# EAGLE design ESP_LoRa_1.5 (EAGLE 9.6.2)
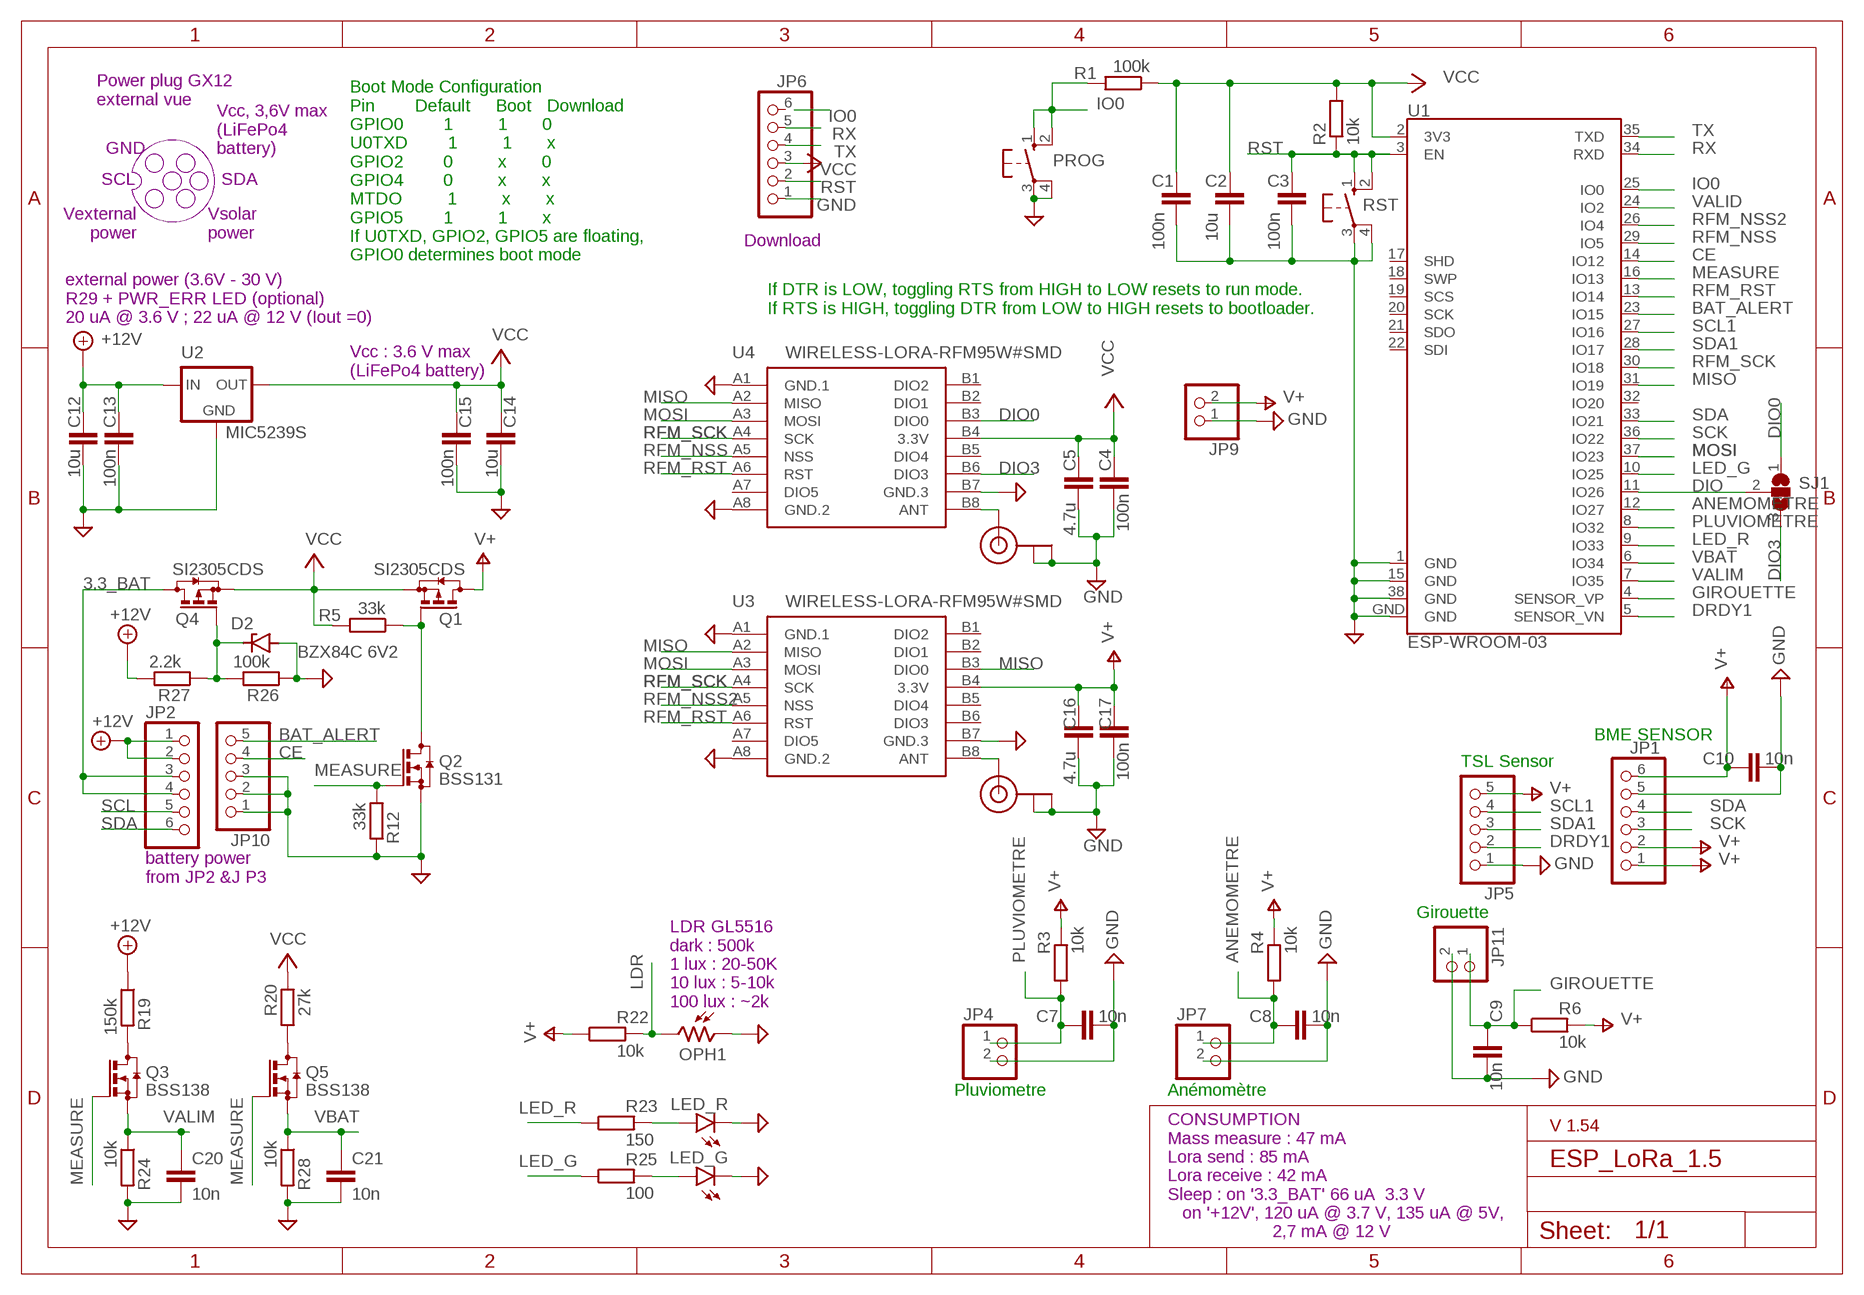
[diagram p0: schematic, sheet 1]

## Parts
C1  100n  CC1206  [C1206]
C2  10u  CC1210  [C1210]
C3  100n  CC1206  [C1206]
C4  100n  CC1206  [C1206]
C5  4.7u  CC1210  [C1210]
C7  10n  CC1206  [C1206]
C8  10n  CC1206  [C1206]
C9  10n  CC1206  [C1206]
C10  10n  CC1206  [C1206]
C12  10u  CC1210  [C1210]
C13  100n  CC1206  [C1206]
C14  10u  CC1210  [C1210]
C15  100n  CC1206  [C1206]
C16  4.7u  CC1210  [C1210]
C17  100n  CC1206  [C1206]
C20  10n  CC1206  [C1206]
C21  10n  CC1206  [C1206]
D2  BZX84C 6V2  BZX84CSMD  [TO236]
J1  U.FL  [U.FL]
J2  U.FL  [U.FL]
JP1  PINHD-1X6  [1X06]
JP2  PINHD-1X6  [1X06]
JP4  PINHD-1X2  [1X02]
JP5  PINHD-1X5  [1X05]
JP6  PINHD-1X6  [1X06]
JP7  PINHD-1X2  [1X02]
JP9  PINHD-1X2  [1X02]
JP10  PINHD-1X5  [1X05]
JP11  PINHD-1X2  [1X02]
LED_G  LEDSMT1206  [1206]
LED_R  LEDSMT1206  [1206]
OPH1  VT93N2  [VT900]
PROG  10-XX  [B3F-10XX]
Q1  SI2305CDS  [SOT23]
Q2  BSS131  [SOT23]
Q3  BSS138  [SOT23]
Q4  SI2305CDS  [SOT23]
Q5  BSS138  [SOT23]
R1  100k  RR1206  [R1206]
R2  10k  RR1206  [R1206]
R3  10k  RR1206  [R1206]
R4  10k  RR1206  [R1206]
R5  33k  RR1206  [R1206]
R6  10k  RR1206  [R1206]
R12  33k  RR1206  [R1206]
R19  150k  RR1206  [R1206]
R20  27k  RR1206  [R1206]
R22  10k  RR1206  [R1206]
R23  150  RR1206  [R1206]
R24  10k  RR1206  [R1206]
R25  100  RR1206  [R1206]
R26  100k  RR1206  [R1206]
R27  2.2k  RR1206  [R1206]
R28  10k  RR1206  [R1206]
RST  10-XX  [B3F-10XX]
SJ1  SJ2W  [SJ_2]
U1  ESP-WROOM-03  [ESP-WROOM-03]
U2  MIC5239S  [SOT223]
U3  WIRELESS-LORA-RFM95W#SMD  [WIRELESS-LORA-RFM95W#SMD]
U4  WIRELESS-LORA-RFM95W#SMD  [WIRELESS-LORA-RFM95W#SMD]

## Nets
3.3_BAT: JP2.3 JP2.4 Q4.3(D)
+12V: C12.1 C13.1 JP2.1 JP2.2 R19.1 R27.2 U2.1(IN)
ANEMOMETRE: C8.1 JP7.1 R4.1 U1.12(IO27)
ANT2: J2.3(SIGNAL) U4.B8(ANT)
ANT3: J1.3(SIGNAL) U3.B8(ANT)
BAT_ALERT: JP10.5 U1.23(IO15)
CE: JP10.4 U1.14(IO12)
DIO: SJ1.2 U1.11(IO26)
DIO0: SJ1.1 U4.B3(DIO0)
DIO3: SJ1.3 U4.B6(DIO3)
DRDY1: JP5.2 U1.5(SENSOR_VN)
GIROUETTE: C9.1 JP11.1 R6.1 U1.4(SENSOR_VP)
GND: C1.2 C2.2 C3.2 C4.2 C5.2 C7.2 C8.2 C9.2 C10.2 C12.2 C13.2 C14.2 C15.2 C16.2 C17.2 C20.2 C21.2 D2.A J1.1(GND) J1.2(GND) J2.1(GND) J2.2(GND) JP1.5 JP4.2 JP5.1 JP6.1 JP7.2 JP9.1 JP10.1 JP10.2 JP10.3 JP11.2 LED_G.C LED_R.C OPH1.1 PROG.3(P) PROG.4(P1) Q2.2(S) R12.2 R24.2 R26.1 R28.2 RST.3(P) RST.4(P1) U1.1(GND) U1.15(GND) U1.38(GND) U1.GND U2.2(GND) U2.4(GND) U3.A1(GND.1) U3.A8(GND.2) U3.B7(GND.3) U4.A1(GND.1) U4.A8(GND.2) U4.B7(GND.3)
IO0: PROG.1(S) PROG.2(S1) R1.2 U1.25(IO0)
LDR: OPH1.2 R22.2
LED_G: R25.1 U1.10(IO25)
LED_R: R23.1 U1.9(IO33)
MEASURE: Q2.1(G) Q3.1(G) Q5.1(G) R12.1 U1.16(IO13)
MISO: U1.31(IO19) U3.A2(MISO) U3.B3(DIO0) U4.A2(MISO)
MOSI: U1.37(IO23) U3.A3(MOSI) U4.A3(MOSI)
N$1: Q1.1(G) Q2.3(D) R5.1
N$2: Q3.3(D) R19.2
N$5: Q5.3(D) R20.1
N$7: LED_R.A R23.2
N$8: LED_G.A R25.2
N$35: D2.C Q4.1(G) R26.2 R27.1
PLUVIOMETRE: C7.1 JP4.1 R3.1 U1.8(IO32)
RFM_NSS: U1.29(IO5) U4.A5(NSS)
RFM_NSS2: U1.26(IO4) U3.A5(NSS)
RFM_RST: U1.13(IO14) U3.A6(RST) U4.A6(RST)
RFM_SCK: U1.30(IO18) U3.A4(SCK) U4.A4(SCK)
RST: C3.1 JP6.2 R2.1 RST.1(S) RST.2(S1) U1.3(EN)
RX: JP6.5 U1.34(RXD)
SCK: JP1.3 U1.36(IO22)
SCL: JP2.5
SCL1: JP5.4 U1.27(IO16)
SDA: JP1.4 JP2.6 U1.33(IO21)
SDA1: JP5.3 U1.28(IO17)
TX: JP6.4 U1.35(TXD)
V+: C10.1 C16.1 C17.1 JP1.1 JP1.2 JP1.6 JP5.5 JP9.2 Q1.3(D) R3.2 R4.2 R6.2 R22.1 U3.B4(3.3V)
VALID: U1.24(IO2)
VALIM: C20.1 Q3.2(S) R24.1 U1.7(IO35)
VBAT: C21.1 Q5.2(S) R28.1 U1.6(IO34)
VCC: C1.1 C2.1 C4.1 C5.1 C14.1 C15.1 JP6.3 Q1.2(S) Q4.2(S) R1.1 R2.2 R5.2 R20.2 U1.2(3V3) U2.3(OUT) U4.B4(3.3V)
Unconnected: JP6.6 U1.17(SHD) U1.18(SWP) U1.19(SCS) U1.20(SCK) U1.21(SDO) U1.22(SDI) U1.32(IO20) U3.A7(DIO5) U3.B1(DIO2) U3.B2(DIO1) U3.B5(DIO4) U3.B6(DIO3) U4.A7(DIO5) U4.B1(DIO2) U4.B2(DIO1) U4.B5(DIO4)

## Notes on the sheet
- Power plug GX12
  external vue
- GND
- Vcc, 3,6V max
  (LiFePo4
  battery)
- SCL | SDA
- Download
- Vexternal
  power
- Vsolar 
  power
- Boot Mode Configuration
  Pin        Default     Boot   Download
  GPIO0        1         1       0
  U0TXD        1         1       x
  GPIO2        0         x       0
  GPIO4        0         x       x
  MTDO         1         x       x
  GPIO5        1         1       x
  If U0TXD, GPIO2, GPIO5 are floating, 
  GPIO0 determines boot mode
- If DTR is LOW, toggling RTS from HIGH to LOW resets to run mode.
  If RTS is HIGH, toggling DTR from LOW to HIGH resets to bootloader.
- external power (3.6V - 30 V)
  R29 + PWR_ERR LED (optional)
  20 uA @ 3.6 V ; 22 uA @ 12 V (Iout =0)
- Vcc : 3.6 V max 
  (LiFePo4 battery)
- BME SENSOR
- TSL Sensor
- battery power
  from JP2 &J P3
- Girouette
- LDR GL5516
  dark : 500k
  1 lux : 20-50K
  10 lux : 5-10k
  100 lux : ~2k
- Pluviometre | Anémomètre
- V 1.54
- CONSUMPTION
  Mass measure : 47 mA
  Lora send : 85 mA
  Lora receive : 42 mA
  Sleep : on '3.3_BAT' 66 uA  3.3 V
     on '+12V', 120 uA @ 3.7 V, 135 uA @ 5V,
                       2,7 mA @ 12 V

## Library data of the parts
C1-C5 C7-C10 C12-C17 C20 C21 = eagle-ltspice:C: CAPACITOR, European symbol; SPICEMODEL: NONE; SPICEPREFIX: C
D2 = diode:BZX84CSMD: Z DIODE
J1 J2 = microbuilder:U.FL: U.FL Antenna Connector
JP1 JP2 JP6 = pinhead:PINHD-1X6: PIN HEADER
JP4 JP7 JP9 JP11 = pinhead:PINHD-1X2: PIN HEADER
JP5 JP10 = pinhead:PINHD-1X5: PIN HEADER
LED_G LED_R = led:LED: LED OSRAM: - CHIPLED LG R971, LG N971, LY N971, LG Q971, LY Q971, LO R971, LY R971 LH N974, LH R974 LS Q976, LO Q976, LY Q976 LO Q996 - Hyper CHIPLED LW Q18S LB Q993, LB Q99A, LB R99A - SideLED LS A670, LO A670, LY A670, LG A670, LP A670 LB A673, LV A673, LT A673, LW A673 LH A674 LY A675 LS A676, LA A676, LO A676, LY A676, LW A676 LS A679, LY A679, LG A679 - Hyper Micro SIDELED® LS Y876, LA Y876, LO Y876, LY Y876 LT Y87S - SmartLED LW L88C, LW L88S LB L89C, LB L89S, LG L890 LS L89K, LO L89K, LY L89K LS L896, LA L896, LO L896, LY L896 - TOPLED LS T670, LO T670, LY T670, LG T670, LP T670 LSG T670, LSP T670, LSY T670, LOP T670, LYG T670 LG T671, LOG T671, LSG T671 LB T673, LV T673, LT T673, LW T673 LH T674 LS T676, LA T676, LO T676, LY T676, LB T676, LH T676, LSB T676, LW T676 LB T67C, LV T67C, LT T67C, LS T67K, LO T67K, LY T67K, LW E67C LS E67B, LA E67B, LO E67B, LY E67B, LB E67C, LV E67C, LT E67C LW T67C LS T679, LY T679, LG T679 LS T770, LO T770, LY T770, LG T770, LP T770 LB T773, LV T773, LT T773, LW T773 LH T774 LS E675, LA E675, LY E675, LS T675 LS T776, LA T776, LO T776, LY T776, LB T776 LHGB T686 LT T68C, LB T68C - Hyper Mini TOPLED® LB M676 - Mini TOPLED Santana® LG M470 LS M47K, LO M47K, LY M47K Source: http://www.osram.convergy.de LUXEON: - LUMILED® LXK2-PW12-R00, LXK2-PW12-S00, LXK2-PW14-U00, LXK2-PW14-V00 LXK2-PM12-R00, LXK2-PM12-S00, LXK2-PM14-U00 LXK2-PE12-Q00, LXK2-PE12-R00, LXK2-PE12-S00, LXK2-PE14-T00, LXK2-PE14-U00 LXK2-PB12-K00, LXK2-PB12-L00, LXK2-PB12-M00, LXK2-PB14-N00, LXK2-PB14-P00, LXK2-PB14-Q00 LXK2-PR12-L00, LXK2-PR12-M00, LXK2-PR14-Q00, LXK2-PR14-R00 LXK2-PD12-Q00, LXK2-PD12-R00, LXK2-PD12-S00 LXK2-PH12-R00, LXK2-PH12-S00 LXK2-PL12-P00, LXK2-PL12-Q00, LXK2-PL12-R00 Source: www.luxeon.com KINGBRIGHT: KA-3528ASYC Source: www.kingbright.com
OPH1 = photo-elements:VT9: Photoconductive Cell VT900 Series Source: http://optoelectronics.perkinelmer.com/content/Datasheets/DTS_vt900seriesdatasheet.pdf
PROG RST = switch-omron:10-XX: OMRON SWITCH; MPN: B3F-1000; OC_FARNELL: 176432; OC_NEWARK: 36M3542
Q1 Q4 = transistor-small-signal-perso:SI2305CDS: P-CHANNEL MOS FET
Q2 = transistor-small-signal-perso:BSS131: N-CHANNEL MOS FET
Q3 Q5 = detect:BSS138: N-CHANNEL MOS FET
R1-R6 R12 R19 R20 R22-R28 = eagle-ltspice:R: RESISTOR, European symbol; SPICEMODEL: NONE; SPICEPREFIX: R
SJ1 = jumper:SJ2W: SMD solder JUMPER
U1 = esp32-sparkfun (1):ESP-WROOM-03; OC_FARNELL: unknown
U2 = micrel:MIC5239S: LDO REGULATOR
U3 U4 = diy-modules:WIRELESS-LORA-RFM95W: 868/915 MHz LoRa Radio Transceiver Module based on SX1276 chip Click here to find device on ebay.com <http://www.ebay.com/sch/RFM95W+transceiver>

## Board
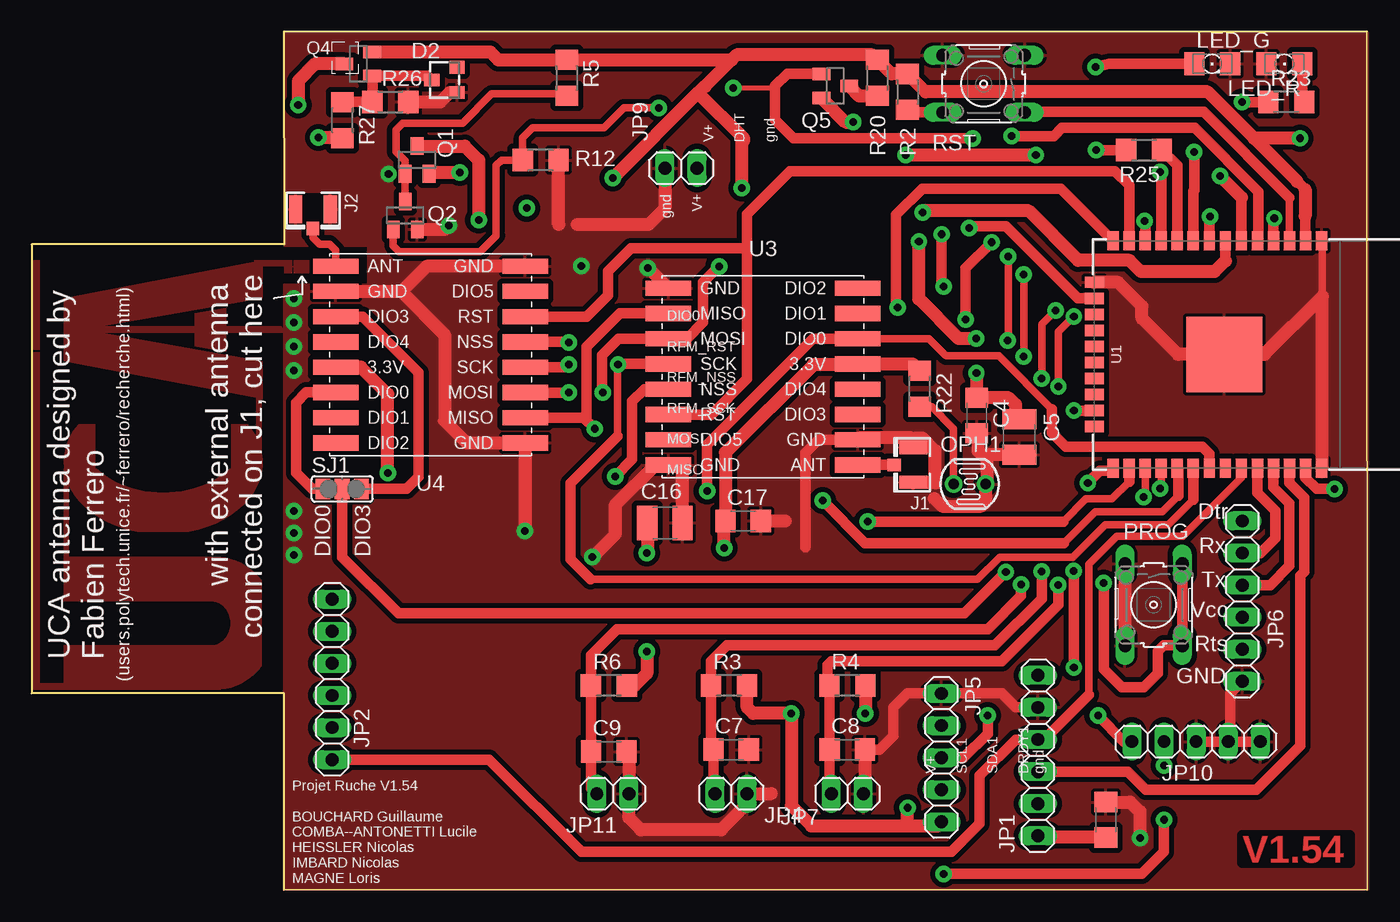
[diagram p1: board, top side]
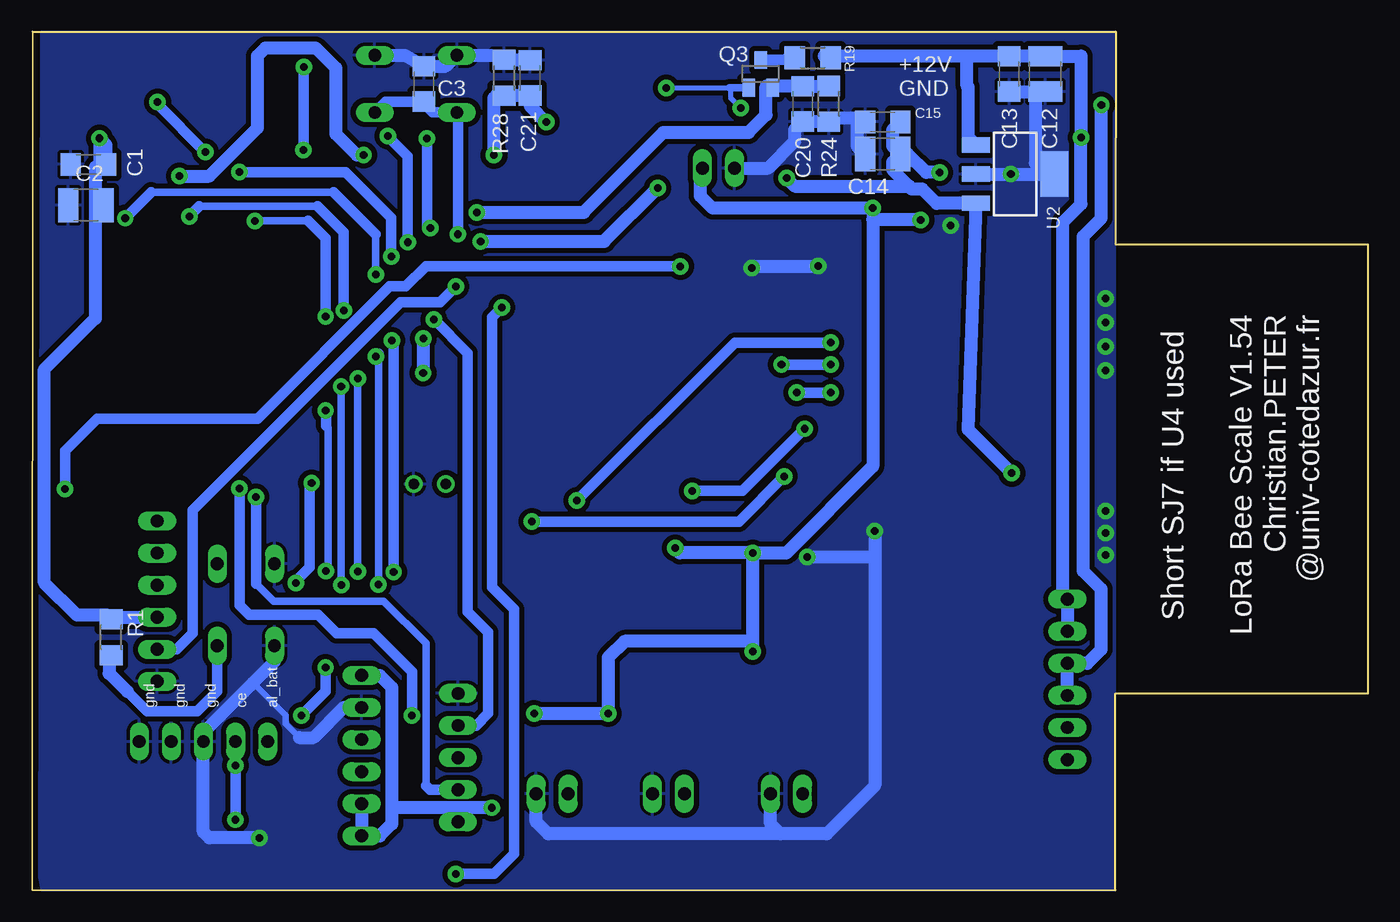
[diagram p2: board, bottom side, seen from below]

Size 105.78 x 67.97 mm. Coordinates in mm from the lower left corner, seen from the top.
Outline: 20,0.02 20,15.57 0,15.57 0,51.13 20,51.13 19.98,67.97 105.76,67.97 105.78,0.01
Outline: 105.76,0.02 20,0
Copper layers (1*16): Top 0.035mm / dielectric 1.5mm / Bottom 0.035mm
Design rules "default *": minimum track width 6mil, minimum drill 0.35mm, track to track 12mil, track to pad 6mil, pad to pad 6mil, via to via 6mil, smd to smd 6mil, copper to edge 0mil, drill to drill 6mil, minimum pad ring 10mil, minimum via ring 8mil, stop-mask expansion 4mil, vias tented up to drill 0mil, thermal gap 10mil

### Footprints (pad centres in the part's own frame; a part is rotated, then mirrored left to right if it is on the bottom)
C1206 = smd 1.6 x 1.8: 1 -1.4,0; 2 1.4,0
C1210 = smd 1.6 x 2.7: 1 -1.4,0; 2 1.4,0
TO236 = smd 1 x 1.2: A -1,-1; C 0,1; NC 1,-1
U.FL = smd 2.2 x 1.05: 1 0,1.375; 2 0,-1.375 | smd 1.05 x 1: 3 1.525,0
1X06 = drill 1.016 long: 1 -6.35,0; 2 -3.81,0; 3 -1.27,0; 4 1.27,0; 5 3.81,0; 6 6.35,0
1X02 = drill 1.016 long: 1 -1.27,0; 2 1.27,0
1X05 = drill 1.016 long: 1 -5.08,0; 2 -2.54,0; 3 0,0; 4 2.54,0; 5 5.08,0
1206 = smd 1.6 x 1.803: A -1.422,0; C 1.422,0
VT900 = drill 0.8 pad 1.4: 1 -1.27,0; 2 1.27,0
B3F-10XX = drill 1.016 long: 1 -3.251,2.261; 2 3.251,2.261; 3 -3.251,-2.261; 4 3.251,-2.261
SOT23 = smd 1 x 1.4: 1 -0.95,-1.1; 2 0.95,-1.1; 3 0,1.1
R1206 = smd 1.6 x 1.803: 1 -1.422,0; 2 1.422,0
SJ_2 = smd 1.168 x 1.6: 1 -1.524,0; 2 0,0; 3 1.524,0
ESP-WROOM-03 = smd 0.9 x 1.5: 1 7.7,9; 2 6.43,9; 3 5.16,9; 4 3.89,9; 5 2.62,9; 6 1.35,9; 7 0.08,9; 8 -1.19,9; 9 -2.46,9; 10 -3.73,9; 11 -5,9; 12 -6.27,9; 13 -7.54,9; 14 -8.81,9; 25 -8.81,-9; 26 -7.54,-9; 27 -6.27,-9; 28 -5,-9; 29 -3.73,-9; 30 -2.46,-9; 31 -1.19,-9; 32 0.08,-9; 33 1.35,-9; 34 2.62,-9; 35 3.89,-9; 36 5.16,-9; 37 6.43,-9; 38 7.7,-9 | smd 1.5 x 0.9: 15 -10.3,5.715; 16 -10.3,4.445; 17 -10.3,3.175; 18 -10.3,1.905; 19 -10.3,0.635; 20 -10.3,-0.635; 21 -10.3,-1.905; 22 -10.3,-3.175; 23 -10.3,-4.445; 24 -10.3,-5.715 | smd 6 x 6: GND 0,0
SOT223 = smd 1.219 x 2.235: 1 -2.311,-3.099; 2 0,-3.099; 3 2.311,-3.099 | smd 3.6 x 2.2: 4 0,3.099
WIRELESS-LORA-RFM95W#SMD = smd 3.6 x 1.2: A1 -7.5,7; A2 -7.5,5; A3 -7.5,3; A4 -7.5,1; A5 -7.5,-1; A6 -7.5,-3; A7 -7.5,-5; A8 -7.5,-7; B1 7.5,7; B2 7.5,5; B3 7.5,3; B4 7.5,1; B5 7.5,-1; B6 7.5,-3; B7 7.5,-5; B8 7.5,-7

### Placement (x,y rotation side)
C1  101.34,57.45 180 bottom
C2  101.55,54.23 180 bottom
C3  74.77,63.83 90 bottom
C4  74.86,37.58 270 top
C5  78.22,35.87 270 top
C7  55.4,11.13 0 top
C8  64.61,11.13 0 top
C9  45.72,10.97 0 top
C10  85.09,5.57 90 top
C12  25.56,64.63 270 bottom
C13  28.42,64.63 270 bottom
C14  38.42,58.28 180 bottom
C15  38.42,60.82 180 bottom
C16  50.16,29.07 0 top
C17  56.36,29.23 0 top
C20  44.77,62.25 270 bottom
C21  66.36,64.31 90 bottom
D2  32.7,64.15 90 top
J1  69.85,33.67 180 top
J2  22.29,53.9 270 top
JP1  79.69,10.65 90 top
JP2  23.81,16.68 270 top
JP4  55.4,7.64 0 top
JP5  72.07,10.49 270 top
JP6  95.89,22.88 90 top
JP7  64.61,7.64 0 top
JP9  51.44,57.17 0 top
JP10  92.23,11.76 180 top
JP11  46.04,7.64 0 top
LED_G  93.5,65.42 0 top
LED_R  99.22,65.42 180 top
OPH1  74.3,32.15 180 top
PROG  88.87,22.59 270 top
Q1  30.53,57.81 0 top
Q2  29.6,53.41 0 top
Q3  48.1,64.63 0 bottom
Q4  25.88,65.42 90 top
Q5  63.66,63.67 270 top
R1  99.54,20.02 270 bottom
R2  69.37,63.2 90 top
R3  55.25,16.21 0 top
R4  64.61,16.21 0 top
R5  42.39,64.31 90 top
R6  45.72,16.21 0 top
R12  40.32,57.8 0 top
R19  43.97,65.9 180 bottom
R20  66.99,64.31 90 top
R22  70.34,39.69 270 top
R23  99.38,62.4 0 top
R24  42.7,62.25 270 bottom
R25  88.11,58.59 180 top
R26  28.42,62.4 180 top
R27  24.62,60.95 270 top
R28  68.42,64.31 90 bottom
RST  75.41,63.83 180 top
SJ1  24.61,31.77 0 top
U1  94.47,42.41 0 top
U2  27.94,56.69 270 bottom
U3  57.94,40.66 0 top
U4  31.59,42.4 180 top

### Tracks (layer width: path | path; a pad name or v marks a point on that pad's centre or on a via)
3.3_BAT  (via drill 0.6 pad 1.3)
  Top 1.016: Q4.3 22.54,65.42 22.51,65.45 21.11,64.05 v21.11,62.16
  Bottom 1.016: JP2.4 JP2.3 22.23,17.95 21.11,19.07 21.11,23.83 22.54,25.26 22.54,51.77 21.11,53.2 v21.11,62.16
+12V  (via drill 0.6 pad 1.3)
  Top 1.016: R27.2 24.57,59.58 v22.73,59.58
  Bottom 1.016: 31.59,66.03 C13.1 C12.1 22.73,66.03 v22.73,59.58 22.73,54.31 24.15,52.88 24.15,23.38 JP2.1 JP2.2 | 31.59,66.03 43.06,66.03 42.93,65.9 R19.1 | U2.1 31.67,59.64 31.67,63.6 31.75,63.67 31.75,65.87 31.59,66.03
ANEMOMETRE  (via drill 0.6 pad 1.3)
  Top 0.61: v82.55,45.42 81.32,44.19 v81.32,39.86
  Top 0.813: JP7.1 63.21,7.77 C8.1 63.19,11.15 R4.1 63.02,16.37 63.02,17.79 63.34,18.11 76.84,18.11 81.31,22.59 v81.31,24.15 | v88.17,52.98 88.2,52.95 U1.12
  Bottom 0.61: 81.31,39.85 v81.31,24.15 | v88.17,52.98 83.92,52.98
  Bottom 0.813: v81.32,39.86 81.31,39.85 | v82.55,45.42 82.55,51.61 83.92,52.98
ANT
  pour Top: 14.99,15.88 0.14,15.88 0.14,42.58 0.64,42.58 0.64,16.38 2.54,16.38 2.54,19.38 14.19,19.38 14.32,19.38 14.46,19.4 14.59,19.43 14.73,19.48 14.85,19.54 14.97,19.61 15.09,19.69 15.2,19.79 15.3,19.89 15.39,20 15.48,20.12 15.55,20.25 15.61,20.39 15.67,20.53 15.71,20.67 15.74,20.82 15.76,20.97 15.76,21.13 15.76,21.28 15.74,21.43 15.71,21.58 15.67,21.72 15.61,21.87 15.55,22 15.48,22.13 15.39,22.25 15.3,22.36 15.2,22.46 15.09,22.56 14.97,22.64 14.85,22.71 14.73,22.77 14.59,22.82 14.46,22.85 14.32,22.87 14.19,22.88 2.54,22.88 2.54,33.38 2.57,33.38 2.55,33.99 2.61,34.6 2.75,35.19 2.99,35.8 3.31,36.36 3.72,36.87 5.03,36.87 5.03,33.38 5.17,33.38 5.5,33.08 5.85,32.82 6.22,32.58 6.63,32.35 7.06,32.15 7.5,31.97 7.96,31.82 8.44,31.7 8.92,31.6 9.42,31.53 9.92,31.48 10.42,31.47 10.92,31.48 11.42,31.53 11.92,31.6 12.41,31.7 12.88,31.82 13.35,31.97 13.78,32.15 14.21,32.35 14.62,32.58 14.99,32.82 15.34,33.08 15.67,33.38 15.82,33.38 15.82,36.87 17.13,36.87 17.25,36.72 17.37,36.57 17.49,36.4 17.59,36.24 17.69,36.08 17.79,35.91 17.79,38.97 2.54,41.88 2.54,46.87 17.64,49.75 17.64,49.88 20.14,49.88 20.14,49.87 20.64,49.87 20.64,49.39 20.76,49.39 20.76,49.87 22.54,49.87 22.54,48.85 20.77,48.85 20.77,49.33 20.64,49.33 20.64,48.86 19.99,48.86 19.99,49.38 18.31,49.38 18.31,46.87 5.61,44.63 12.91,44.63 12.91,45.68 15.4,46.12 15.4,44.63 19.99,44.63 19.99,44.88 20.39,44.88 20.39,43.87 19.99,43.87 19.99,44.13 15.4,44.13 15.4,42.62 14.21,42.84 13.08,43.01 13.08,43.05 12.91,43.07 12.91,44.13 5.61,44.13 18.31,41.88 18.31,38.88 18.24,38.89 18.24,34.63 18.3,34.09 18.29,33.54 18.21,33 18.06,32.45 17.83,31.93 17.55,31.44 17.18,30.94 16.76,30.49 16.3,30.07 15.76,29.67 15.17,29.33 14.57,29.03 13.89,28.75 13.2,28.54 12.49,28.38 8.35,28.38 7.75,28.51 7.15,28.69 6.57,28.9 6.03,29.14 5.51,29.41 5.02,29.73 4.58,30.05 4.16,30.4 3.79,30.8 3.47,31.19 3.19,31.61 2.95,32.05 2.95,26.38 14.99,26.38 14.99,26.36 15.4,26.31 15.81,26.21 16.21,26.08 16.59,25.9 16.96,25.69 17.31,25.45 17.65,25.17 17.96,24.86 18.24,24.52 18.24,17.73 17.96,17.39 17.65,17.08 17.31,16.8 16.96,16.56 16.59,16.35 16.21,16.17 15.81,16.04 15.4,15.94 14.99,15.89
ANT1
  pour Top: 0.64,42.77 0.14,42.77 0.14,49.88 0.64,49.88
ANT2
  Top 0.61: U4.B8 24.09,50.65 23.59,51.15 22.8,51.15 22.29,51.66 J2.3
ANT3
  Top 0.813: U3.B8 65.46,33.67 J1.3
BAT_ALERT  (via drill 0.6 pad 1.3)
  Top 0.813: JP10.5 86.52,11.76 v84.46,13.83 | v82.55,17.64 82.55,25.27 v82.53,25.26 | U1.23 v82.55,37.96
  Bottom 0.61: 82.52,36.78 82.36,36.62 82.36,25.43
  Bottom 0.813: v84.46,13.83 82.55,15.73 v82.55,17.64 | v82.53,25.26 82.36,25.43 | 82.52,36.78 82.52,37.93 v82.55,37.96
CE  (via drill 0.6 pad 1.3)
  Top 0.813: U1.14 84.01,53.05 81.53,55.54 70.55,55.54 68.48,53.46 68.48,46.25 v68.6,46.12 | v72.23,1.29 87.95,1.29 89.69,3.03 v89.69,5.57 | v89.69,9.86 JP10.4
  Bottom 0.813: v68.6,46.12 69.37,45.35 69.37,23.99 67.63,22.24 67.63,2.87 69.22,1.29 v72.23,1.29 | v89.69,9.86 v89.69,5.57
DIO  (via drill 0.6 pad 1.3)
  Top 0.61: v77.35,50.17 77.35,43.55
  Top 0.813: SJ1.2 24.61,26.37 29.05,21.92 73.9,21.92 v77.17,25.19 | v89.38,56.85 89.47,56.76 U1.11 | 77.35,43.55 v77.31,43.51
  Bottom 0.813: v89.38,56.85 80.96,56.85 77.35,53.24 v77.35,50.17 | v77.31,43.51 77.17,43.37 v77.17,25.19
DIO0
  Top 0.813: SJ1.1 22.23,31.76 20.96,33.04 20.96,38.59 21.77,39.4 U4.B3
DIO3
  Top 0.813: SJ1.3 29.69,31.76 30.67,32.75 30.67,40.94 26.21,45.4 U4.B6
DRDY1  (via drill 0.6 pad 1.3)
  Top 0.813: U1.5 97.16,51.48 97.16,55.31 92.12,60.34 81.6,60.34 80.96,59.71 v77.63,59.71 | v76.04,51.29 73.98,49.23 v73.98,45.19
  Bottom 0.813: v77.63,59.71 76.04,58.12 v76.04,51.29 | v73.98,45.19 71.29,42.5 71.29,22.02 69.67,20.41 69.67,13.99 70.62,13.03 JP5.2
GIROUETTE  (via drill 0.6 pad 1.3)
  Top 0.61: v78.58,48.75 v78.58,42.24
  Top 0.813: JP11.1 44.32,8.08 C9.1 44.3,10.99 R6.1 44.3,18.6 46.36,20.65 75.72,20.65 78.36,23.29 v78.36,24.19 | v98.43,53.2 98.36,53.13 U1.4
  Bottom 0.61: v78.36,24.19 78.36,42.46 | 96.36,55.26 81.93,55.26 | 78.58,51.91 v78.58,48.75
  Bottom 0.813: 78.36,42.46 v78.58,42.24 | 78.58,51.91 81.93,55.26 | 96.36,55.26 v98.43,53.2
GND  (via drill 0.6 pad 1.3)
  Top 0.61: U1.1 102.24,51.34 102.24,47.01
  Top 0.813: JP6.1 94.93,15.57 94.93,11.92 JP10.2 | JP10.2 JP10.1 | JP10.2 JP10.3 | JP1.5 77.95,14.46 76.84,15.57 JP5.1 69.37,15.57 68.26,14.46 68.26,12.24 67.15,11.13 C8.2 | C9.2 47.31,10.78 | U3.B7 62.31,35.65 61.28,34.62 61.28,27.16
  Top 1.016: C16.2 51.57,33.48 51.59,33.51 51.45,33.65 U3.A8 49.4,33.65 46.24,30.49 46.24,28.19 v44.42,26.37 | U4.B7 29.29,47.4 | 29.29,47.4 32.7,43.99 32.7,37.16 34.46,35.4 U4.A1 39.09,28.47 v39.05,28.43 | U4.A8 39.08,49.39 31.28,49.39 29.29,47.4 | 41.74,52.68 R12.2 | 102.17,46.94 97.64,42.41 U1.GND 90.8,42.41 87.95,45.26 87.95,46.21 86.04,48.12 U1.15 | 102.17,46.94 102.24,47.01 | 102.17,46.94 U1.38 | J1.2 69.85,35.58 | U3.B7 65.62,35.83 69.6,35.83 69.85,35.58 | 47.31,10.78 JP11.2 47.31,5.73 48.26,4.78 54.61,4.78 56.67,6.84 JP4.2 58.58,7.64 | C8.2 66.01,7.77 JP7.2 | C10.2 87.02,6.97 87.79,6.21 v87.79,4.14 | PROG.3 PROG.4 | JP9.1 50.17,53.99 48.86,52.68 43.22,52.68 | U3.A1 48.83,49.27 v48.82,49.27 | R26.1 32.38,62.4 33.13,63.15 D2.A | 71.48,31.02 72.11,30.39 75.2,30.39 75.57,30.76 OPH1.1 75.72,32.31 75.72,34.38 75.79,34.45 | C4.2 74.95,36.08 74.95,34.78 75.28,34.45 75.79,34.45 | J1.1 71.54,32.29 71.6,32.24 71.6,32.9 71.56,32.94 71.56,34.79 70.54,35.8 70.08,35.8 69.85,35.58 | Q2.2 32.69,52.31 32.73,52.31 v33.04,52.63 | C17.2 59.69,29.22 | C5.2 78.2,34.45 75.79,34.45
  Bottom 0.508: 88.3,16.41 85.73,13.83 85.73,13.19 84.61,12.08
  Bottom 1.016: JP9.1 47.51,57.16 45.4,59.28 45.4,60.21 44.79,60.82 R24.2 42.38,60.82 42.07,61.13 40.77,61.13 40.45,60.82 40.45,58.91 C14.2 | C13.2 C12.2 26.35,63.07 26.35,57.57 25.48,56.69 v28.28,56.69 U2.2 | C21.2 66.99,65.71 67.01,65.73 R28.2 69.42,66.09 RST.4 73.02,65.23 C3.2 76.27,66.09 RST.3 | PROG.4 86.61,18.1 88.3,16.41 92.23,12.48 JP10.3 92.23,4.62 91.76,4.14 v87.79,4.14 | 84.61,12.08 83.5,12.08 81.12,14.46 JP1.5 | v39.05,28.43 39.05,26.33 | 39.05,26.33 39.05,8.27 42.86,4.46 46.51,4.46 | JP11.2 47.31,5.25 46.51,4.46 | 46.51,4.46 64.93,4.46 65.88,5.41 JP7.2 | 39.05,26.33 39.09,26.37 v44.42,26.37 | v48.82,49.27 48.69,49.39 v43.56,49.39 v43.55,49.4
  other vias: 20.76,46.85 20.76,44.94 20.76,43.04 20.76,41.13 20.76,30.02 20.76,28.27 20.76,26.53
  pour Top (isolate 0.406): 20,0.02 20,47.96 26.67,47.96 26.67,50.97 20.05,50.97 20.05,67.94 105.84,67.92 105.84,67.91 105.84,0.02
  pour Bottom (isolate 0.406): 20,0 20,67.97 105.1,67.97 105.28,1.01 105.09,0
IO0  (via drill 0.6 pad 1.3)
  Top 0.813: PROG.1 PROG.2 91.08,19.38 89.69,19.38 89.22,18.91 89.22,17.16 88.11,16.05 86.36,16.05 84.92,17.49 v84.92,24.3 | U1.25 85.44,33.19 84.61,33.19 v83.66,32.24
  Bottom 0.813: 98.27,15.73 96.68,14.14 92.71,14.14 91.13,15.72 PROG.2 | v84.92,24.3 84.92,24.46 83.82,25.56 83.82,32.08 v83.66,32.24
  Bottom 1.016: 98.27,15.73 99.7,17.16 99.7,18.44 R1.2
LDR
  Top 0.61: R22.2 71.29,38.27 73.03,36.54 OPH1.2
LED_G
  Top 0.813: R25.1 90.74,57.39 U1.10
LED_R  (via drill 0.6 pad 1.3)
  Top 0.813: R23.1 97.93,62.38 v95.86,62.38 | v92.08,58.43 92.08,55.42 92.01,55.35 U1.9
  Bottom 0.813: v95.86,62.38 95.86,62.22 v92.08,58.43
MEASURE  (via drill 0.6 pad 1.3)
  Top 0.406: 58.9,63.67 58.74,63.51 v55.56,63.51
  Top 0.61: Q2.1 28.65,51.02 29.12,50.56 35.54,50.56 36.8,51.81 36.8,57.38 37.22,57.8 R12.1 38.9,59.58 39.7,60.38 45.35,60.38 46.9,61.93 v49.69,61.93
  Top 0.813: U1.16 82.86,46.85 77.17,52.54 74.36,52.54 v74.25,52.43 | v74.53,59.52 60.35,59.52 58.9,60.97 58.9,63.67 59.85,64.63 Q5.1
  Bottom 0.406: v49.69,61.93 50.48,62.72 50.48,63.53 50.58,63.51 v55.56,63.51
  Bottom 0.61: 50.58,63.51 Q3.1
  Bottom 0.813: v74.53,59.52 74.53,52.72 v74.25,52.43
MISO  (via drill 0.6 pad 1.3)
  Top 0.61: 80.8,38.09 76.6,42.29 72.45,42.29 72.38,42.35 72.37,42.35 71.07,43.65 U3.B3
  Top 0.813: U3.A2 46.59,45.65 43.97,43.04 43.97,37.48 43.9,37.4 43.74,37.4 | 43.74,37.4 U4.A2 | U3.B3 61.9,43.65 53.5,35.26 v53.5,31.61 | v44.61,36.53 43.74,37.4 | U1.31 93.28,34.53 92.71,35.1 81.92,35.1 80.8,36.21 80.8,38.09
  Bottom 0.813: v53.5,31.61 49.53,31.61 v44.61,36.53
MOSI  (via drill 0.6 pad 1.3)
  Top 0.813: v45.24,39.39 45.2,39.43 45.2,42.35 46.5,43.65 U3.A3 51.9,43.65 53.18,44.94 53.18,48.12 v54.45,49.39 | v42.55,39.39 39.11,39.39 U4.A3 | U1.37 100.9,32.66 101.79,31.76 v103.19,31.76
  Bottom 0.813: v45.24,39.39 v42.55,39.39 | v54.45,49.39 74.61,49.39 76.2,47.8 77.47,47.8 87.95,37.32 100.65,37.32 103.19,34.78 v103.19,31.76
N$1
  Top 0.61: Q2.3 29.58,54.53 Q1.1 29.58,57.73 28.86,58.46 28.86,60.18 29.4,60.73 34.14,60.73 36.45,63.04 42.23,63.04
  Top 0.813: 42.23,63.04 R5.1
N$2
  Bottom 0.813: Q3.3 46.2,65.73 46.03,65.9 R19.2
N$5
  Top 1.016: Q5.3 65.55,62.89 R20.1
N$7
  Top 0.813: LED_R.A 100.64,62.56 R23.2
N$8  (via drill 0.6 pad 1.3)
  Top 0.813: LED_G.A 85.37,65.42 v84.28,65.17 | R25.2 v84.3,58.59
  Bottom 0.813: v84.28,65.17 v84.3,58.59
N$35
  Top 0.813: R27.1 24.62,62.4 R26.2 26.99,64.45 Q4.1 31.38,64.47 D2.C
PLUVIOMETRE  (via drill 0.6 pad 1.3)
  Top 0.61: v81.12,45.89 80.01,44.78 v80.01,40.5
  Top 0.813: JP4.1 54,7.77 C7.1 53.82,11.31 R3.1 53.82,18.11 55.07,19.37 76.28,19.37 80,23.09 v80,25.23 | U1.8 93.28,53.34 v93.35,53.34
  Bottom 0.61: v80.01,40.5 80.01,25.25 | 92.55,54.14 83.17,54.14
  Bottom 0.813: v80,25.23 80.01,25.25 | 83.17,54.14 81.12,52.08 v81.12,45.89 | v93.35,53.34 92.55,54.14
RFM_NSS  (via drill 0.6 pad 1.3)
  Top 0.61: 81.76,27.48 84.24,29.96 89.55,29.96 90.81,31.22
  Top 0.813: U4.A5 42.5,43.4 v42.55,43.35 | v62.66,30.84 66.02,27.48 81.76,27.48 | v62.66,30.84 | 90.81,31.22 90.81,33.34 U1.29
  Bottom 0.813: v42.55,43.35 50.15,43.35 v62.66,30.84
RFM_NSS2  (via drill 0.6 pad 1.3)
  Top 0.61: 81.7,29.17 83.52,30.98 85.58,30.98 86.93,32.33
  Top 0.813: U3.A5 48.53,39.65 47.58,38.7 47.58,34.11 v46.23,32.76 | 81.7,29.17 v66.21,29.17 | 86.93,32.33 U1.26
  Bottom 0.813: v46.23,32.76 49.82,29.17 v66.21,29.17
RFM_RST
  Top 0.813: U3.A6 53.83,37.65 56.67,40.5 56.67,50.82 | 56.67,50.82 47.47,50.82 45.64,48.99 45.64,47.08 43.96,45.4 U4.A6 | 56.67,50.82 56.67,53.51 60.08,56.92 85.81,56.92 86.93,55.8 U1.13
RFM_SCK  (via drill 0.6 pad 1.3)
  Top 0.61: 92.01,30.9 90.05,28.94 85.04,28.94 82.46,26.37 76.68,26.37 74.92,24.61 44.29,24.61 | 46.4,35.94 46.4,41.65
  Top 0.813: U3.A4 46.49,41.65 | 46.49,41.65 46.4,41.65 | 46.49,41.65 v46.45,41.61 | v42.55,41.61 42.34,41.4 U4.A4 | U1.30 92.01,30.9 | 44.29,24.61 42.69,26.21 42.69,32.22 46.4,35.94
  Bottom 0.813: v46.45,41.61 v42.55,41.61
RST  (via drill 0.6 pad 1.3)
  Top 0.61: U1.3 99.63,54.82
  Top 0.813: R2.1 69.58,61.57 RST.2 | 99.63,54.82 92.83,61.61 78.7,61.61 RST.1 | v72.07,51.93 72.07,47.96 v72.23,47.8
  Bottom 0.813: RST.1 77.8,62.43 76.04,62.43 75.41,62.43 C3.1 74.77,62.25 74.1,61.57 RST.2 72.04,61.46 72.04,51.93 v72.07,51.93 | JP6.2 94.37,19.06 93.08,20.35 93.08,30.06 76.6,46.54 73.49,46.54 v72.23,47.8
RX
  Top 0.813: U1.34 97.09,31.46 98.5,30.04 98.5,27.87 97.31,26.68 JP6.5
SCK
  Top 0.813: U1.36 99.63,32.24 100.82,31.05 100.82,25.21 100.49,24.88 100.49,11.44 97,7.95 88.27,7.95 86.84,9.38 JP1.3
SCL1  (via drill 0.6 pad 1.3)
  Top 0.61: U1.27 88.2,31.27
  Top 0.813: 88.2,31.27 v88.06,31.14
  Bottom 0.61: 74.59,8.25 74.59,15.96 74.61,15.98 74.61,19.54 77.95,22.88 86.68,22.88 88.06,24.26
  Bottom 0.813: v88.06,31.14 88.06,24.26 | 74.59,8.25 74.3,7.95 JP5.4
SDA
  Top 0.61: 83.73,15.48 83.73,25.8 85.94,28.01 91.18,28.01 95.82,32.65 U1.33
  Top 0.813: JP2.6 36.25,10.33 43.56,3.03 72.87,3.03 75.09,5.25 75.09,9.06 77.95,11.92 JP1.4 80.17,11.92 83.73,15.48
SDA1  (via drill 0.6 pad 1.3)
  Top 0.61: U1.28 89.47,31.88
  Top 0.813: 89.47,31.88 v89.38,31.79 | v75.72,13.83 75.72,12.4 73.82,10.49 JP5.3
  Bottom 0.813: v75.72,13.83 75.7,13.85 75.7,17.3 78.73,20.33 81.66,20.33 83.14,21.81 88.63,21.81 89.38,22.56 v89.38,31.79
TX
  Top 0.813: U1.35 98.36,31.9 99.62,30.63 99.62,25.66 98.11,24.15 JP6.4
V+  (via drill 0.6 pad 1.3)
  Top 1.016: C16.1 48.77,26.71 v48.74,26.68 | v48.74,18.91 48.74,17.16 47.78,16.21 R6.2 | R3.2 56.67,14.47 57.15,13.99 v60.17,13.99 60.17,6.68 61.75,5.1 69.37,5.1 | 69.37,5.1 71.76,5.1 JP5.5 | R4.2 v66.03,13.99 v66.04,13.99 | 69.37,5.1 v69.37,6.52 | C10.1 79.82,4.17 JP1.1 | v54.85,27.08 54.85,29.12 C17.1 54.96,34.65 61.91,41.61 65.4,41.61 U3.B4 69.8,41.65 R22.1 | Q1.3 34.3,58.91 35.41,57.8 v35.41,53.07
  Bottom 1.016: JP9.2 52.86,57.01 52.86,54.94 51.91,53.99 v39.21,53.99 39.21,53.11 | JP1.6 78.26,17 77.31,16.05 77.31,6.52 | 77.31,6.52 77.31,5.25 78.26,4.3 JP1.1 JP1.2 | v48.74,26.68 48.74,26.71 54.49,26.71 v54.85,27.08 | v48.74,26.68 48.74,19.7 | 48.74,19.7 v48.74,18.91 | 48.74,19.7 58.9,19.7 60.17,18.43 60.17,14.14 | 60.17,14.14 v60.17,13.99 | v66.04,13.99 60.33,13.99 60.17,14.14 | v69.37,6.52 77.31,6.52 | v48.74,26.68 46.07,26.68 39.21,33.54 39.21,53.11 | v35.41,53.07 39.17,53.07 39.21,53.11
VALIM  (via drill 0.6 pad 1.3)
  Top 0.813: U1.7 94.55,49.82
  Top 1.016: 94.55,49.82 93.69,48.97 87.86,48.97 86.96,49.86 82.88,49.86 78.97,53.77 70.7,53.77 v70.59,53.66
  Bottom 1.016: R24.1 43.34,63.67 43.36,63.65 C20.1 47.67,63.65 | 47.67,63.65 47.55,63.53 Q3.2 | v70.59,53.66 62.12,53.66 55.79,59.98 49.05,59.98 47.67,61.37 47.67,63.65
VBAT  (via drill 0.6 pad 1.3)
  Top 0.813: U1.6 95.82,54.85
  Top 1.016: Q5.2 64.47,60.81 v65.09,60.81 | 95.82,54.85 v94.14,56.53 | v79.54,58.2 79.5,58.2 79.49,58.2 v69.22,58.2 v69.22,58.19
  Bottom 1.016: 69.03,62.91 69.01,62.89 69.22,62.73 | v94.14,56.53 91.76,56.53 87.95,60.34 87.95,66.05 87.31,66.69 83.34,66.69 81.76,65.1 81.76,59.86 80.1,58.2 v79.54,58.2 | v69.22,58.19 69.22,62.73 | v65.09,60.81 66.36,62.08 C21.1 68.4,62.91 R28.1 69.06,62.89 69.22,62.73
VCC  (via drill 0.6 pad 1.3)
  Top 0.813: 100.23,56.12 100.87,55.47 | 100.87,53.36 100.9,53.33 U1.2
  Top 1.016: 100.87,55.47 100.87,53.36 | 96.82,59.52 100.23,56.12 | 96.82,59.52 93.15,63.2 70.8,63.2 R2.2 68.1,64.62 R20.2 66.59,66.13 55.84,66.13 55.45,65.73 | 52.8,63.13 53.34,63.67 53.34,63.63 55.45,65.73 | 52.8,63.13 v46.04,56.37 | 55.45,65.73 R5.2 36.96,65.73 36.32,66.37 Q4.2 | C5.1 77.95,37.55 77.95,38.43 77.4,38.98 C4.1 74.83,39.01 v74.83,40.95 | v100.45,59.52 96.82,59.52 | v74.81,43.67 73.43,43.67 70.28,46.81 v70.28,51.35 | v56.26,55.58 56.26,59.19 56.42,59.35 56.42,59.51 52.8,63.13 | v28.2,33.01 28.2,39.28 26.08,41.4 U4.B4 | Q1.2 31.59,56.83 v33.93,56.83
  Bottom 1.016: 36.35,55.74 36.13,55.52 35.31,55.52 34.18,54.38 U2.3 31.67,36.48 v28.2,33.01 | 36.35,55.74 37.65,57.04 37.65,57.64 C14.1 | C15.1 37.65,60.18 37.65,58.91 C14.1 | JP6.3 99.37,21.61 R1.1 99.86,21.76 102.24,21.76 104.83,24.35 104.83,41.23 100.78,45.27 100.78,53.67 | v46.04,56.37 45.4,55.74 36.35,55.74 | 100.78,53.67 100.78,57.24 100.33,57.45 100.45,57.58 v100.45,59.52 99.94,59.01 C1.1 | v74.81,43.67 74.83,43.65 v74.83,40.95 | v70.28,51.35 60.49,51.35 v56.26,55.58 | v33.93,56.83 35,56.83 36.46,58.28 C14.1 | C2.1 100.71,53.67 100.78,53.67

### Text on the board
Top: V1.54
tNames: V+ / / DHT / / gnd | gnd / / V+ | with external antenna / connected on J1, cut here | DIO0 / / RFM_RST / / RFM_NSS / / RFM_SCK / / MOSI / / MISO | Dtr | Rx | DIO0 | DIO3 | Tx | Vcc | Rts | UCA antenna designed by / Fabien Ferrero | GND | (users.polytech.unice.fr/~ferrero/recherche.html) | V+ / / SCL1 / / SDA1 / / DRDY1 / gnd | Projet Ruche V1.54 / / BOUCHARD Guillaume / COMBA--ANTONETTI Lucile / HEISSLER Nicolas / IMBARD Nicolas / MAGNE Loris
bNames: +12V / GND | LoRa Bee Scale V1.54 / Christian.PETER / @univ-cotedazur.fr | Short SJ7 if U4 used | gnd / / gnd / / gnd / / ce / / al_bat